# EAGLE design simduino (EAGLE 6.4)
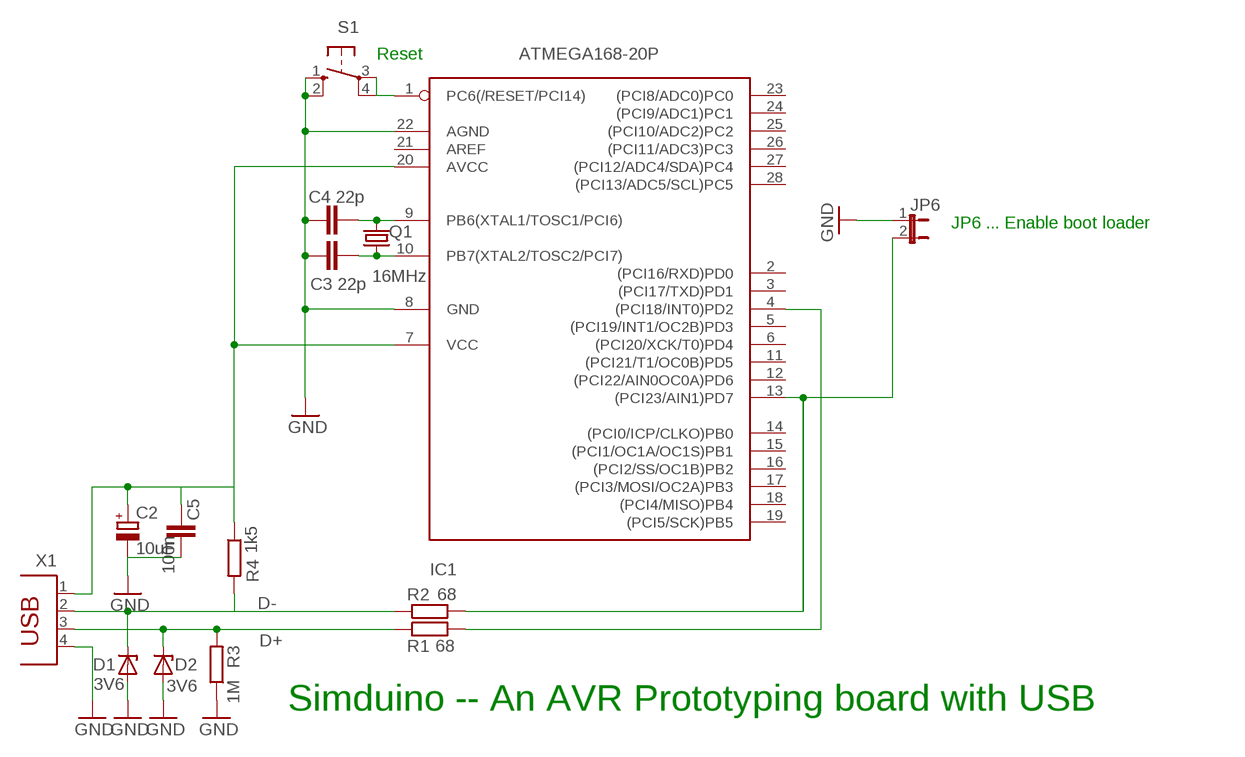
[diagram p0: schematic, sheet 1]

## Parts
C2  10uF  CPOL-EUE2,5-6E  [E2,5-6E]
C3  22p  C-EU025-024X044  [C025-024X044]
C4  22p  C-EU025-024X044  [C025-024X044]
C5  100n  C-EU025_050-025X075  [C025_050-025X075]
D1  3V6  ZENER-DIODEDO34-7  [DO34Z7]
D2  3V6  ZENER-DIODEDO34-7  [DO34Z7]
IC1  ATMEGA168-20P  [DIL28-3]
JP6  JP1E  [JP1]
Q1  16MHz  CRYSTALHC49S  [HC49/S]
R1  68  R-EU_0207/10  [0207/10]
R2  68  R-EU_0207/10  [0207/10]
R3  1M  R-EU_0207/10  [0207/10]
R4  1k5  R-EU_0207/10  [0207/10]
S1  10-XX  [B3F-10XX]
X1  PN61729  [PN61729]

## Nets
+5USB: C2.+ C5.1 IC1.7(VCC) IC1.20(AVCC) R4.1 X1.1
D+: D2.C R1.1 R3.2 X1.3
D-: D1.C R2.1 R4.2 X1.2
GND: C2.- C3.1 C4.1 C5.2 D1.A D2.A IC1.8(GND) IC1.22(AGND) JP6.1 R3.1 S1.1(S) S1.2(S1) X1.4
N$1: IC1.13((PCI23/AIN1)PD7) JP6.2 R2.2
N$2: IC1.1(PC6(/RESET/PCI14)) S1.3(P) S1.4(P1)
N$3: IC1.4((PCI18/INT0)PD2) R1.2
N$9: C3.2 IC1.10(PB7(XTAL2/TOSC2/PCI7)) Q1.1
N$10: C4.2 IC1.9(PB6(XTAL1/TOSC1/PCI6)) Q1.2
Unconnected: IC1.2((PCI16/RXD)PD0) IC1.3((PCI17/TXD)PD1) IC1.5((PCI19/INT1/OC2B)PD3) IC1.6((PCI20/XCK/T0)PD4) IC1.11((PCI21/T1/OC0B)PD5) IC1.12((PCI22/AIN0OC0A)PD6) IC1.14((PCI0/ICP/CLKO)PB0) IC1.15((PCI1/OC1A/OC1S)PB1) IC1.16((PCI2/SS/OC1B)PB2) IC1.17((PCI3/MOSI/OC2A)PB3) IC1.18((PCI4/MISO)PB4) IC1.19((PCI5/SCK)PB5) IC1.21(AREF) IC1.23((PCI8/ADC0)PC0) IC1.24((PCI9/ADC1)PC1) IC1.25((PCI10/ADC2)PC2) IC1.26((PCI11/ADC3)PC3) IC1.27((PCI12/ADC4/SDA)PC4) IC1.28((PCI13/ADC5/SCL)PC5)

## Notes on the sheet
- Reset
- JP6 ... Enable boot loader
- Simduino -- An AVR Prototyping board with USB

## Library data of the parts
C2 = rcl:CPOL-EU: POLARIZED CAPACITOR, European symbol
C3-C5 = rcl:C-EU: CAPACITOR, European symbol
D1 D2 = diode:ZENER-DIODE: Z-Diode
IC1 = avr:ATMEGA168*P: MICROCONTROLLER 16 kBytes FLASH 1 kBytes SRAM 512 Bytes EEPROM USART 8-channel 10 bit ADC
JP6 = jumper:JP1E: JUMPER
Q1 = crystal:CRYSTAL: CRYSTAL
R1-R4 = rcl:R-EU_: RESISTOR, European symbol
S1 = switch-omron:10-XX: OMRON SWITCH
X1 = con-berg:PN61729: BERG USB connector

## Board
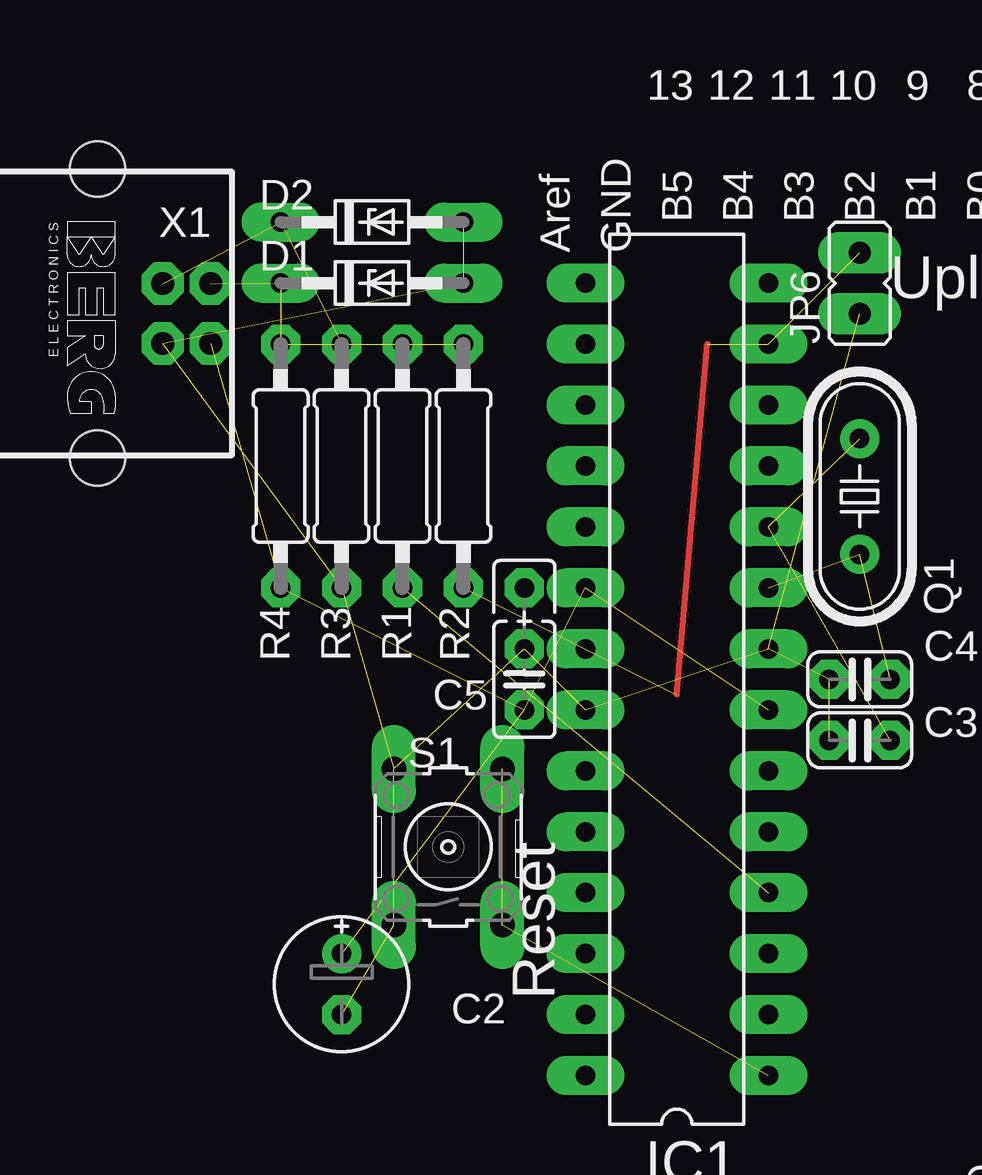
[diagram p1: board, top side]
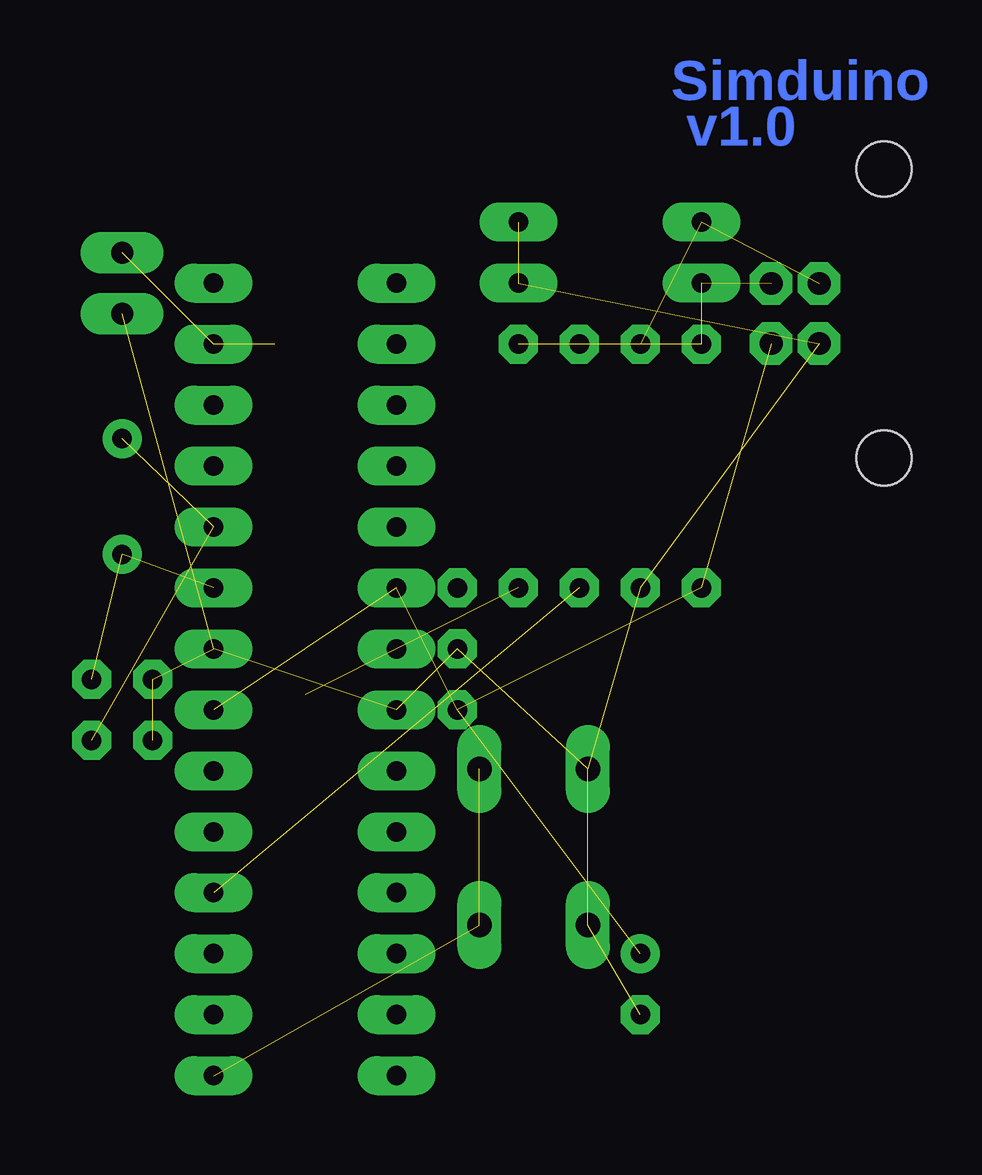
[diagram p2: board, bottom side, seen from below]

No outline drawn. Coordinates in mm, seen from the top.
Copper layers (1*16): Top 0.035mm / dielectric 1.5mm / Bottom 0.035mm
Design rules "mine": minimum track width 12mil, minimum drill 31mil, track to track 8mil, track to pad 8mil, pad to pad 8mil, via to via 8mil, smd to smd 8mil, copper to edge 10mil, drill to drill 20mil, minimum pad ring 16mil, minimum via ring 15mil, stop-mask expansion 4mil, vias tented up to drill 0mil, thermal gap 10mil
bRestrict: area 12.5,48.1 to 17.9,53.5

### Footprints (pad centres in the part's own frame; a part is rotated, then mirrored left to right if it is on the bottom)
E2,5-6E = drill 0.813 pad 1.575: + -1.27,0 | drill 0.813 pad 1.575 octagon: - 1.27,0
C025-024X044 = drill 0.813 octagon: 1 -1.27,0; 2 1.27,0
C025_050-025X075 = drill 0.813 octagon: 1 -1.27,0; 2 1.27,0; 3 3.81,0
DO34Z7 = drill 0.813 long: A 3.81,0; C -3.81,0
DIL28-3 = drill 0.813 long: 1 -16.51,-3.81; 2 -13.97,-3.81; 3 -11.43,-3.81; 4 -8.89,-3.81; 5 -6.35,-3.81; 6 -3.81,-3.81; 7 -1.27,-3.81; 8 1.27,-3.81; 9 3.81,-3.81; 10 6.35,-3.81; 11 8.89,-3.81; 12 11.43,-3.81; 13 13.97,-3.81; 14 16.51,-3.81; 15 16.51,3.81; 16 13.97,3.81; 17 11.43,3.81; 18 8.89,3.81; 19 6.35,3.81; 20 3.81,3.81; 21 1.27,3.81; 22 -1.27,3.81; 23 -3.81,3.81; 24 -6.35,3.81; 25 -8.89,3.81; 26 -11.43,3.81; 27 -13.97,3.81; 28 -16.51,3.81
JP1 = drill 0.914 long: 1 0,-1.27; 2 0,1.27
HC49/S = drill 0.813: 1 -2.413,0; 2 2.413,0
0207/10 = drill 0.813 octagon: 1 -5.08,0; 2 5.08,0
B3F-10XX = drill 1.016 long: 1 -3.251,2.261; 2 3.251,2.261; 3 -3.251,-2.261; 4 3.251,-2.261
PN61729 = drill 0.95 octagon: 1 1.25,4.71; 2 -1.25,4.71; 3 -1.25,2.71; 4 1.25,2.71 | hole 2.3: -6.02,0; 6.02,0

### Placement (x,y rotation side)
C2  13.97,15.24 270 top
C3  35.56,25.4 0 top
C4  35.56,27.94 0 top
C5  21.59,27.94 90 top
D1  15.24,44.45 0 top
D2  15.24,46.99 0 top
IC1  27.94,27.94 90 top
JP6  35.56,44.45 0 top
Q1  35.56,35.56 270 top
R1  16.51,36.83 270 top
R2  19.05,36.83 270 top
R3  13.97,36.83 90 top
R4  11.43,36.83 90 top
S1  18.41,20.95 90 top
X1  3.81,43.18 270 top

### Tracks (layer width: path | path; a pad name or v marks a point on that pad's centre or on a via)
+5USB  (5 unrouted)
D+  (3 unrouted)
D-  (3 unrouted)
GND  (12 unrouted)
N$1  (3 unrouted)
  Top 0.254: 27.94,27.3 29.21,41.91
N$2  (2 unrouted)
N$3  (1 unrouted)
N$9  (2 unrouted)
N$10  (2 unrouted)

### Text on the board
Bottom: Simduino | v1.0
tPlace: 13 | 12 | 11 | 10 | 9 | 8 | 7 | 6 | 5 | 1 | 0 | B5 | B4 | B3 | B2 | B1 | B0 | D6 | Aref | GND | *D7 | Upload | Reset | +5V | GND | Vin | C0 | C1 | Vin | Simduino v1.0 | 5 | 4 | 3 | 2 | 1 | 0